# EAGLE design eq6-handbox_r1 (EAGLE 5.10)
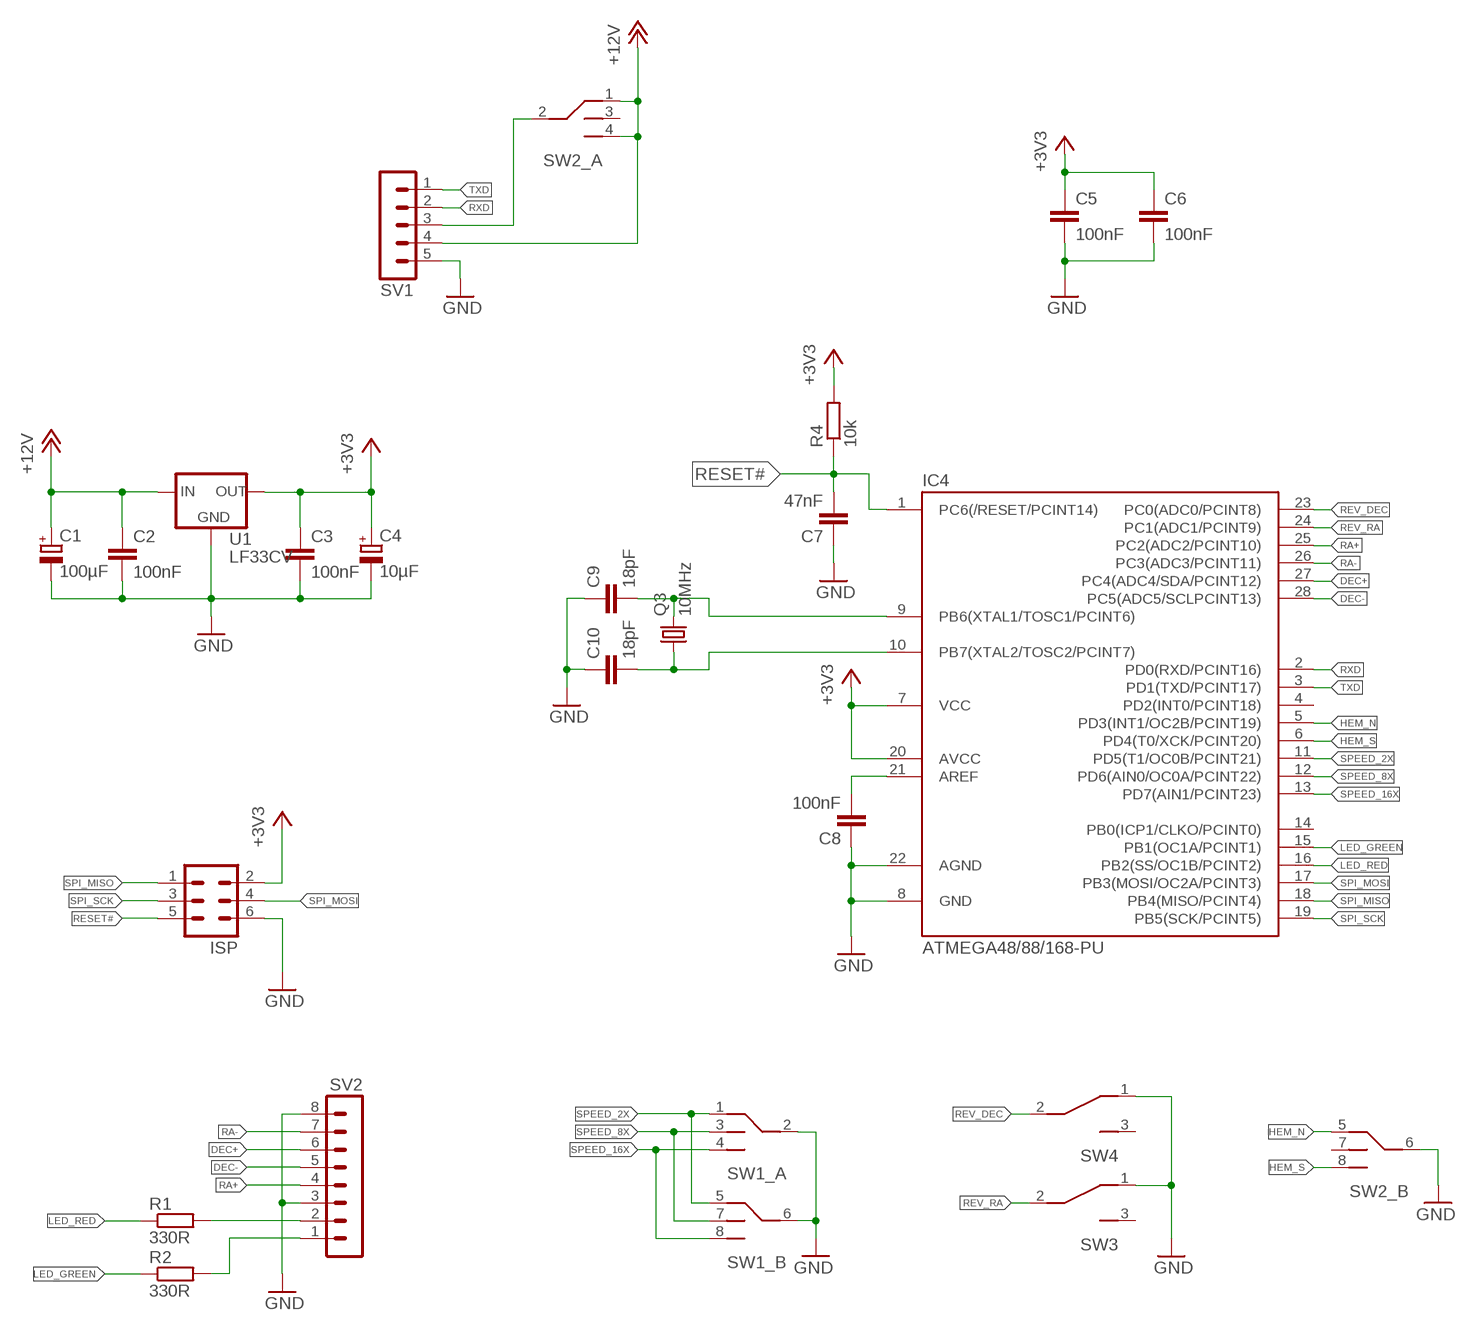
[diagram p0: schematic, sheet 1]

## Parts
C1  100µF  CPOL-EUE2.5-5  [E2,5-5]
C2  100nF  C-EU025-024X044  [C025-024X044]
C3  100nF  C-EU025-024X044  [C025-024X044]
C4  10µF  CPOL-EUE2.5-5  [E2,5-5]
C5  100nF  C-EU025-024X044  [C025-024X044]
C6  100nF  C-EU025-024X044  [C025-024X044]
C7  47nF  C-EU025-024X044  [C025-024X044]
C8  100nF  C-EU025-024X044  [C025-024X044]
C9  18pF  C-EU025-024X044  [C025-024X044]
C10  18pF  C-EU025-024X044  [C025-024X044]
IC4  ATMEGA48/88/168-PU  [DIL28-3]
ISP  ML6  [ML6]
Q3  10MHz  CRYSTALHC49S  [HC49/S]
R1  330R  R-EU_0207/10  [0207/10]
R2  330R  R-EU_0207/10  [0207/10]
R4  10k  R-EU_0207/10  [0207/10]
SV1  MA05-1  [MA05-1]
SV2  MA08-1  [MA08-1]
SW1  EQ6-3X-SWITCH  [EQ6-3X-SWITCH]
SW2  EQ6-3X-SWITCH  [EQ6-3X-SWITCH]
SW3  EQ6-SWITCH  [EQ6-SWITCH]
SW4  EQ6-SWITCH  [EQ6-SWITCH]
U1  LF33CV  LF33CVTO220L  [TO220L1]

## Nets
+3V3: C3.1 C4.+ C5.1 C6.1 IC4.7(VCC) IC4.20(AVCC) ISP.2 R4.2 U1.OUT
+12V: C1.+ C2.1 SV1.4 SW2.1 SW2.4 U1.IN
DEC+: IC4.27(PC4(ADC4/SDA/PCINT12)) SV2.6
DEC-: IC4.28(PC5(ADC5/SCLPCINT13)) SV2.5
GND: C1.- C2.2 C3.2 C4.- C5.2 C6.2 C7.1 C8.1 C9.1 C10.1 IC4.8(GND) IC4.22(AGND) ISP.6 SV1.5 SV2.3 SV2.8 SW1.2 SW1.6 SW2.6 SW3.1 SW4.1 U1.GND
HEM_N: IC4.5(PD3(INT1/OC2B/PCINT19)) SW2.5
HEM_S: IC4.6(PD4(T0/XCK/PCINT20)) SW2.8
LED_GREEN: IC4.15(PB1(OC1A/PCINT1)) R2.1
LED_RED: IC4.16(PB2(SS/OC1B/PCINT2)) R1.1
N$1: SV1.3 SW2.2
N$2: R1.2 SV2.2
N$3: R2.2 SV2.1
N$17: C9.2 IC4.9(PB6(XTAL1/TOSC1/PCINT6)) Q3.2
N$18: C10.2 IC4.10(PB7(XTAL2/TOSC2/PCINT7)) Q3.1
N$19: C8.2 IC4.21(AREF)
RA+: IC4.25(PC2(ADC2/PCINT10)) SV2.4
RA-: IC4.26(PC3(ADC3/PCINT11)) SV2.7
RESET#: C7.2 IC4.1(PC6(/RESET/PCINT14)) ISP.5 R4.1
REV_DEC: IC4.23(PC0(ADC0/PCINT8)) SW4.2
REV_RA: IC4.24(PC1(ADC1/PCINT9)) SW3.2
RXD: IC4.2(PD0(RXD/PCINT16)) SV1.2
SPEED_2X: IC4.11(PD5(T1/OC0B/PCINT21)) SW1.1 SW1.5
SPEED_8X: IC4.12(PD6(AIN0/OC0A/PCINT22)) SW1.3 SW1.7
SPEED_16X: IC4.13(PD7(AIN1/PCINT23)) SW1.4 SW1.8
SPI_MISO: IC4.18(PB4(MISO/PCINT4)) ISP.1
SPI_MOSI: IC4.17(PB3(MOSI/OC2A/PCINT3)) ISP.4
SPI_SCK: IC4.19(PB5(SCK/PCINT5)) ISP.3
TXD: IC4.3(PD1(TXD/PCINT17)) SV1.1
Unconnected: IC4.4(PD2(INT0/PCINT18)) IC4.14(PB0(ICP1/CLKO/PCINT0)) SW2.3 SW2.7 SW3.3 SW4.3

## Library data of the parts
C1 C4 = rcl:CPOL-EU: POLARIZED CAPACITOR, European symbol
C2 C3 C5-C10 = rcl:C-EU: CAPACITOR, European symbol
IC4 = atmega8:ATMEGA48/88/168-PU
ISP = con-harting-ml:ML6: HARTING
Q3 = crystal:CRYSTAL: CRYSTAL
R1 R2 R4 = rcl:R-EU_: RESISTOR, European symbol
SV1 = con-lstb:MA05-1: PIN HEADER
SV2 = con-lstb:MA08-1: PIN HEADER
SW1 SW2 = eigene:EQ6-3X-SWITCH
SW3 SW4 = eigene:EQ6-SWITCH
U1 = eigene:LF33CV: VOLTAGE REGULATOR Vin = max 16V Vout = 3.3V Iout = 500mA

## Board
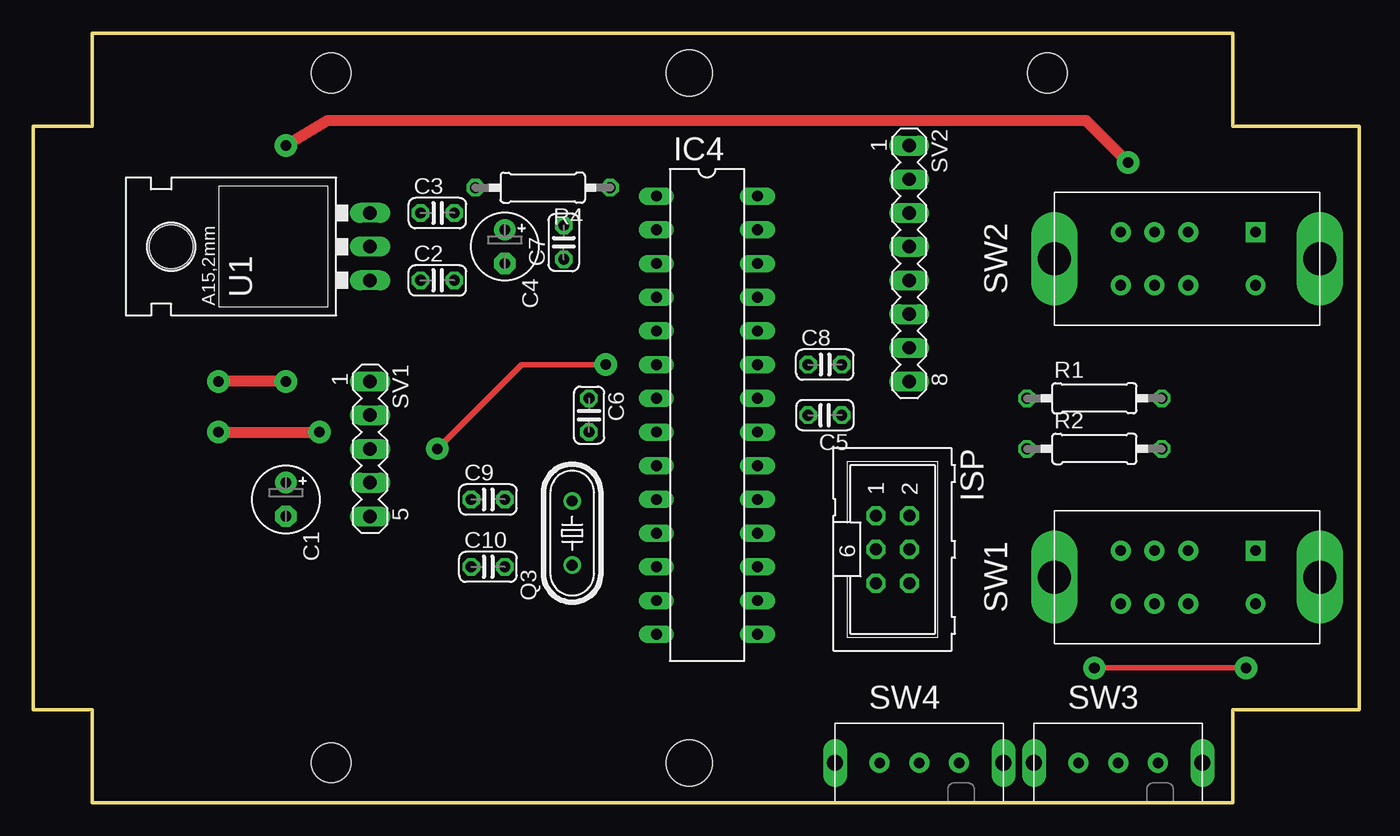
[diagram p1: board, top side]
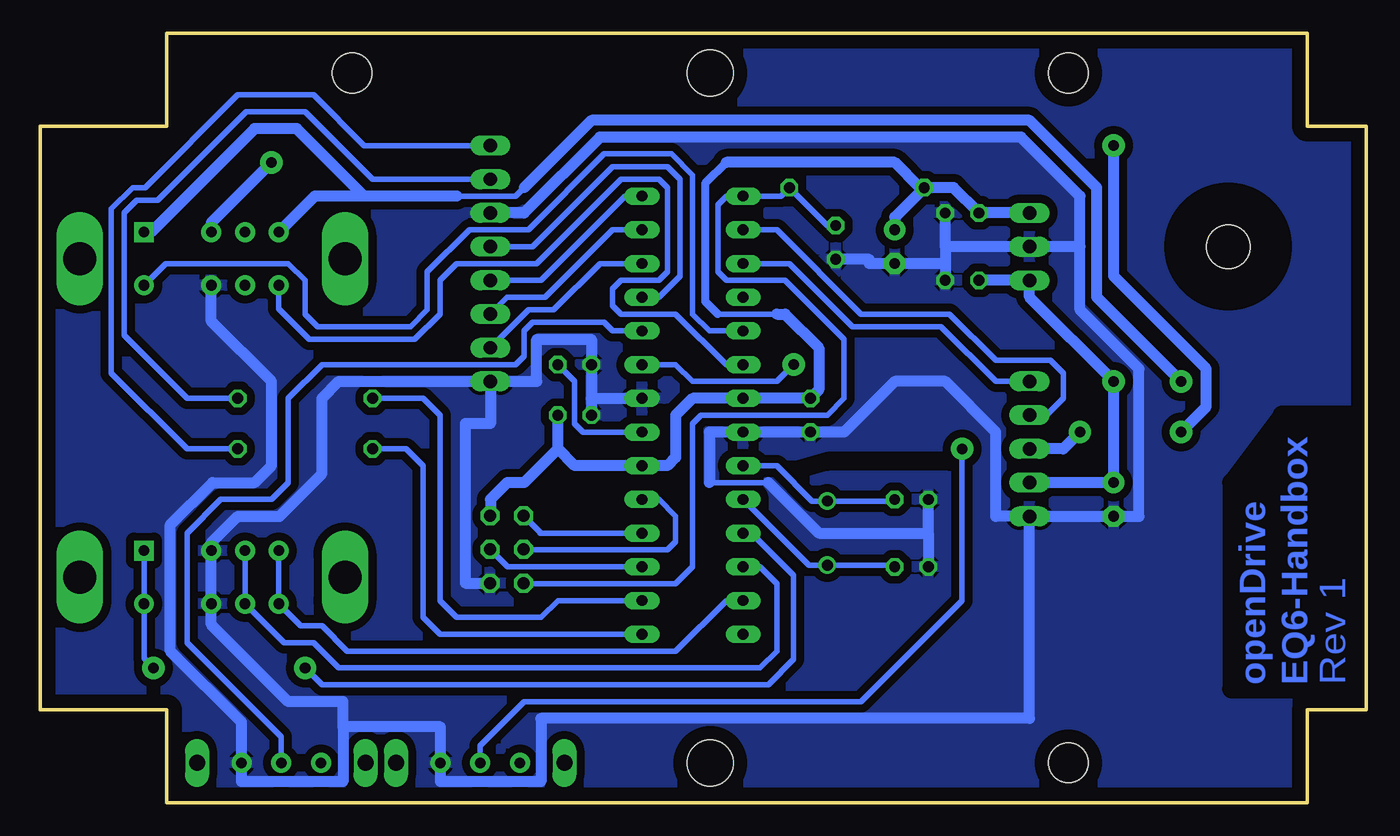
[diagram p2: board, bottom side, seen from below]

Size 100 x 58 mm. Coordinates in mm from the lower left corner, seen from the top.
Outline: 0,7 4.46,7 4.46,0 90.46,0 90.46,7 100,7 100,51 90.46,51 90.46,58 4.46,58 4.46,51 0,51 0,7
Copper layers (1*16): Top 0.035mm / dielectric 1.5mm / Bottom 0.035mm
Design rules "default": minimum track width 10mil, minimum drill 24mil, track to track 8mil, track to pad 8mil, pad to pad 8mil, via to via 8mil, smd to smd 8mil, copper to edge 40mil, drill to drill 8mil, minimum pad ring 10mil, minimum via ring 8mil, stop-mask expansion 4mil, vias tented up to drill 0mil, thermal gap 10mil
Holes 3 mm at 76.46,55 22.46,55 22.46,3
Holes 3.5 mm at 49.46,55 49.46,3
bRestrict: 8 lines

### Footprints (pad centres in the part's own frame; a part is rotated, then mirrored left to right if it is on the bottom)
E2,5-5 = drill 0.813 pad 1.6 round: + -1.27,0 | drill 0.813 pad 1.6 octagon: - 1.27,0
C025-024X044 = drill 0.813 octagon: 1 -1.27,0; 2 1.27,0
DIL28-3 = drill 0.813 long: 1 -16.51,-3.81; 2 -13.97,-3.81; 3 -11.43,-3.81; 4 -8.89,-3.81; 5 -6.35,-3.81; 6 -3.81,-3.81; 7 -1.27,-3.81; 8 1.27,-3.81; 9 3.81,-3.81; 10 6.35,-3.81; 11 8.89,-3.81; 12 11.43,-3.81; 13 13.97,-3.81; 14 16.51,-3.81; 15 16.51,3.81; 16 13.97,3.81; 17 11.43,3.81; 18 8.89,3.81; 19 6.35,3.81; 20 3.81,3.81; 21 1.27,3.81; 22 -1.27,3.81; 23 -3.81,3.81; 24 -6.35,3.81; 25 -8.89,3.81; 26 -11.43,3.81; 27 -13.97,3.81; 28 -16.51,3.81
ML6 = drill 0.914 octagon: 1 -2.54,-1.27; 2 -2.54,1.27; 3 0,-1.27; 4 0,1.27; 5 2.54,-1.27; 6 2.54,1.27
HC49/S = drill 0.813 round: 1 -2.413,0; 2 2.413,0
0207/10 = drill 0.813 octagon: 1 -5.08,0; 2 5.08,0
MA05-1 = drill 1.016 long: 1 -5.08,0; 2 -2.54,0; 3 0,0; 4 2.54,0; 5 5.08,0
MA08-1 = drill 1.016 long: 1 -8.89,0; 2 -6.35,0; 3 -3.81,0; 4 -1.27,0; 5 1.27,0; 6 3.81,0; 7 6.35,0; 8 8.89,0
EQ6-3X-SWITCH = drill 0.8 pad 1.5 square: 1 3,15.16 | drill 0.8 pad 1.5 round: 2 3,10.08; 3 3,7.54; 4 3,5; 5 7,15.16; 6 7,10.08; 7 7,7.54; 8 7,5 | drill 2.5 pad 3 long: P$9 5,20; P$10 5,0
EQ6-SWITCH = drill 0.8 pad 1.5 round: 1 3,9.35; 2 3,6.35; 3 3,3.35 | drill 1.2 long: 4 3,12.7; 5 3,0
TO220L1 = drill 1.016 long: GND 0,-3.81; IN -2.54,-3.81; OUT 2.54,-3.81 | hole 3.302: 0,11.176

### Placement (x,y rotation side)
C1  19.05,22.86 270 top
C2  30.48,39.37 0 top
C3  30.48,44.45 0 top
C4  35.56,41.91 270 top
C5  59.69,29.21 180 top
C6  41.91,29.21 270 top
C7  40.01,42.23 90 top
C8  59.69,33.02 0 top
C9  34.29,22.86 0 top
C10  34.29,17.78 0 top
DRILEGEND  [DRILEGEND]  -6.76,-9.29 0 top  (outside the outline)
IC4  50.8,29.21 270 top
ISP  64.8,19.09 270 top
Q3  40.64,20.32 90 top
R1  80.01,30.48 0 top
R2  80.01,26.67 0 top
R4  38.42,46.35 180 top
SV1  25.4,26.67 270 top
SV2  66.04,40.64 270 top
SW1  77,22 270 top
SW2  77,46 270 top
SW3  75.46,6 270 top
SW4  60.46,6 270 top
U1  21.59,41.91 90 top

### Tracks (layer width: path | path; a pad name or v marks a point on that pad's centre or on a via)
+3V3
  Bottom 0.406: 48.9,36.83 44.45,36.83
  Bottom 0.61: 48.26,48.26 49.85,46.67 49.85,37.78 48.9,36.83
  Bottom 0.813: U1.OUT C3.1 31.11,46.35 R4.2 | C4.+ 35.56,44.13 R4.2 | 48.26,48.26 35.56,48.26 33.66,46.35 R4.2 | 44.45,36.83 43.81,36.83 41.27,34.29 41.27,31.11 C6.1 IC4.7 50.8,30.48 52.07,29.21 52.07,26.04 52.7,25.4 IC4.20 59.69,25.4 60.96,26.67 | ISP.2 66.04,21.66 66.04,22.86 64.77,24.13 63.5,24.13 60.96,26.67 | 60.96,26.67 C5.1
+12V  (via drill 0.8 pad 1.68)
  Top 0.813: v19.05,31.75 v13.97,31.75
  Bottom 0.406: 68.58,45.72 64.14,45.72 63.5,46.35
  Bottom 0.813: C2.1 U1.IN 25.4,38.1 v19.05,31.75 C1.+ SV1.4 | 68.58,45.72 75.56,45.72 | v13.97,31.75 20.32,38.1 20.32,46.35 25.4,51.44 58.42,51.44 63.5,46.35 | 75.56,45.72 80.64,50.8 83.82,50.8 91.62,43 SW2.1 | 75.56,45.72 79.28,45.72 SW2.4
DEC+
  Bottom 0.406: SV2.6 64.77,38.1 61.91,38.1 56.83,43.18 IC4.27
DEC-
  Bottom 0.406: SV2.5 62.23,39.37 55.88,45.72 IC4.28
GND
  Bottom 0.406: 49.53,24.13 45.09,24.13
  Bottom 0.813: 31.75,41.91 31.75,40.64 | 31.75,40.64 C2.2 | 31.75,41.91 C3.2 | 33.02,20.32 C10.1 | 33.02,20.32 41.27,20.32 45.09,24.13 | 33.02,20.32 C9.1 | SV1.5 C1.- 17.14,21.59 17.14,32.7 21.59,37.15 21.59,41.91 | SV1.5 27.94,21.59 27.94,27.94 31.75,31.75 35.56,31.75 39.37,27.94 C6.2 IC4.8 49.53,27.94 49.53,24.13 | 21.59,41.91 U1.GND 31.75,41.91 | 55.88,30.48 IC4.22 58.42,30.48 | 69.85,5.71 69.81,5.71 SW4.1 | SW4.1 69.81,5.67 69.85,5.71 | SV2.8 77.47,31.75 78.74,30.48 78.74,24.8 81.95,21.59 85.09,21.59 87.08,19.6 SW1.2 SW1.6 87.08,13.42 81.28,7.62 77.15,7.62 77.15,5.71 | SW4.1 69.81,1.59 62.23,1.59 62.23,6.35 25.4,6.35 SV1.5 | 77.15,5.71 77.15,1.59 84.81,1.59 SW3.1 84.81,6.07 90.17,11.43 90.17,20.95 87,24.13 83.82,24.13 82.55,25.4 82.55,31.75 87.08,36.28 SW2.6 | 69.85,5.71 77.15,5.71 | 31.75,40.64 C4.- 37.47,40.64 37.47,40.96 C7.1 | SV2.3 63.5,44.45 57.78,50.16 26.04,50.16 21.59,45.72 21.59,41.91 | ISP.6 67.94,16.55 67.94,28.57 66.04,28.57 SV2.8 | 58.42,30.48 C5.2 | 58.42,30.48 C8.1 58.42,34.92 62.55,34.92 62.55,31.75 SV2.8
  pour Bottom (isolate 0.61): -6.35,-2.54 101.6,-2.54 101.6,59.69 -6.35,59.69
HEM_N
  Bottom 0.406: IC4.5 49.53,35.56 50.8,36.83 50.8,47.31 52.39,48.9 57.47,48.9 63.18,43.18 67.63,43.18 70.8,40.01 70.8,37.15 72.07,35.88 79.06,35.88 80.01,36.83 80.01,39.37 81.28,40.64 90.52,40.64 SW2.5
HEM_S
  Bottom 0.406: IC4.6 48.26,33.02 52.07,36.83 56.2,36.83 56.83,37.47 56.83,38.73 56.2,39.37 53.34,39.37 52.7,40.01 52.7,46.35 53.34,46.99 56.2,46.99 62.55,40.64 68.58,40.64 69.85,39.37 69.85,36.83 71.75,34.92 79.69,34.92 82,37.23 SW2.8
LED_GREEN
  Bottom 0.406: IC4.15 69.85,12.7 71.12,13.97 71.12,25.4 72.39,26.67 R2.1
LED_RED
  Bottom 0.406: IC4.16 60.96,15.24 62.23,13.97 68.58,13.97 69.85,15.24 69.85,29.21 71.12,30.48 R1.1
N$1  (via drill 0.8 pad 1.68)
  Top 0.813: v13.97,27.94 v21.59,27.94 | v82.55,48.26 79.38,51.44 22.23,51.44 v19.05,49.53
  Bottom 0.813: SV1.3 22.86,26.67 v21.59,27.94 | v13.97,27.94 12.06,29.84 12.06,32.7 19.05,39.69 v19.05,49.53 | v82.55,48.26 87.08,43.73 SW2.2
N$2
  Bottom 0.406: R1.2 88.9,30.48 93.66,35.24 93.66,44.45 92.71,45.4 91.12,45.4 84.45,52.07 80.01,52.07 74.93,46.99 SV2.2
N$3
  Bottom 0.406: R2.2 88.9,26.67 94.61,32.38 94.61,44.77 93.03,46.35 92.08,46.35 85.09,53.34 79.38,53.34 75.56,49.53 SV2.1
N$17
  Bottom 0.406: C9.2 35.56,22.73 Q3.2 41.78,22.73 44.45,25.4 IC4.9
N$18
  Bottom 0.406: C10.2 35.56,17.91 Q3.1 42.04,17.91 IC4.10
N$19
  Bottom 0.406: IC4.21 59.05,27.94 59.69,28.57 59.69,31.75 C8.2
RA+
  Bottom 0.406: IC4.25 53.34,38.1 51.75,39.69 51.75,46.99 52.7,47.94 56.83,47.94 62.87,41.91 SV2.4
RA-
  Bottom 0.406: IC4.26 57.78,40.64 61.28,37.15 63.18,37.15 SV2.7
RESET#
  Bottom 0.406: C7.2 40.64,43.5 R4.1 44.13,45.72 IC4.1 48.26,45.72 48.9,45.09 48.9,40.01 48.26,39.37 43.81,39.37 39.37,34.92 39.37,30.48 40.64,29.21 50.16,29.21 50.8,28.57 50.8,17.78 52.07,16.51 63.49,16.51 ISP.5
REV_DEC  (via drill 0.8 pad 1.68)
  Top 0.406: v43.18,33.02 36.83,33.02 v30.48,26.67
  Bottom 0.406: IC4.23 52.07,33.02 50.8,31.75 44.45,31.75 v43.18,33.02 | v30.48,26.67 30.48,15.24 38.1,7.62 63.5,7.62 66.81,4.31 SW4.2
REV_RA
  Bottom 0.406: SW3.2 81.81,4.97 88.9,12.06 88.9,20.32 86.36,22.86 82.55,22.86 81.28,24.13 81.28,30.48 78.74,33.02 64.14,33.02 63.5,33.66 63.5,35.56 62.87,36.2 57.47,36.2 56.83,35.56 IC4.24
RXD
  Bottom 0.406: SV1.2 24.13,29.21 22.86,30.48 22.86,32.38 23.81,33.34 27.94,33.34 31.43,36.83 38.1,36.83 44.45,43.18 IC4.2
SPEED_2X  (via drill 0.8 pad 1.68)
  Top 0.406: v80.01,10.16 v91.44,10.16
  Bottom 0.406: SW1.1 SW1.5 92.16,10.88 v91.44,10.16 | IC4.11 46.35,20.32 43.18,17.14 43.18,10.79 45.09,8.89 78.74,8.89 v80.01,10.16
SPEED_8X
  Bottom 0.406: SW1.3 SW1.7 81.61,12.06 79.38,12.06 77.47,10.16 45.72,10.16 44.45,11.43 44.45,16.51 45.72,17.78 IC4.12
SPEED_16X
  Bottom 0.406: IC4.13 48.26,15.24 52.07,11.43 76.83,11.43 78.74,13.34 80.33,13.34 SW1.8 SW1.4
SPI_MISO
  Bottom 0.406: IC4.18 62.3,20.32 62.3,20.4 ISP.1
SPI_MOSI
  Bottom 0.406: IC4.17 64.76,17.78 ISP.4
SPI_SCK
  Bottom 0.406: IC4.19 53.34,22.86 52.07,21.59 52.07,19.68 52.7,19.05 63.49,19.05 ISP.3
TXD
  Bottom 0.406: SV1.1 27.94,31.75 32.07,35.88 38.73,35.88 43.5,40.64 IC4.3

### Text on the board
Bottom: Rev 1 | EQ6-Handbox | openDrive